# EAGLE design Hub (EAGLE 7.6.0)
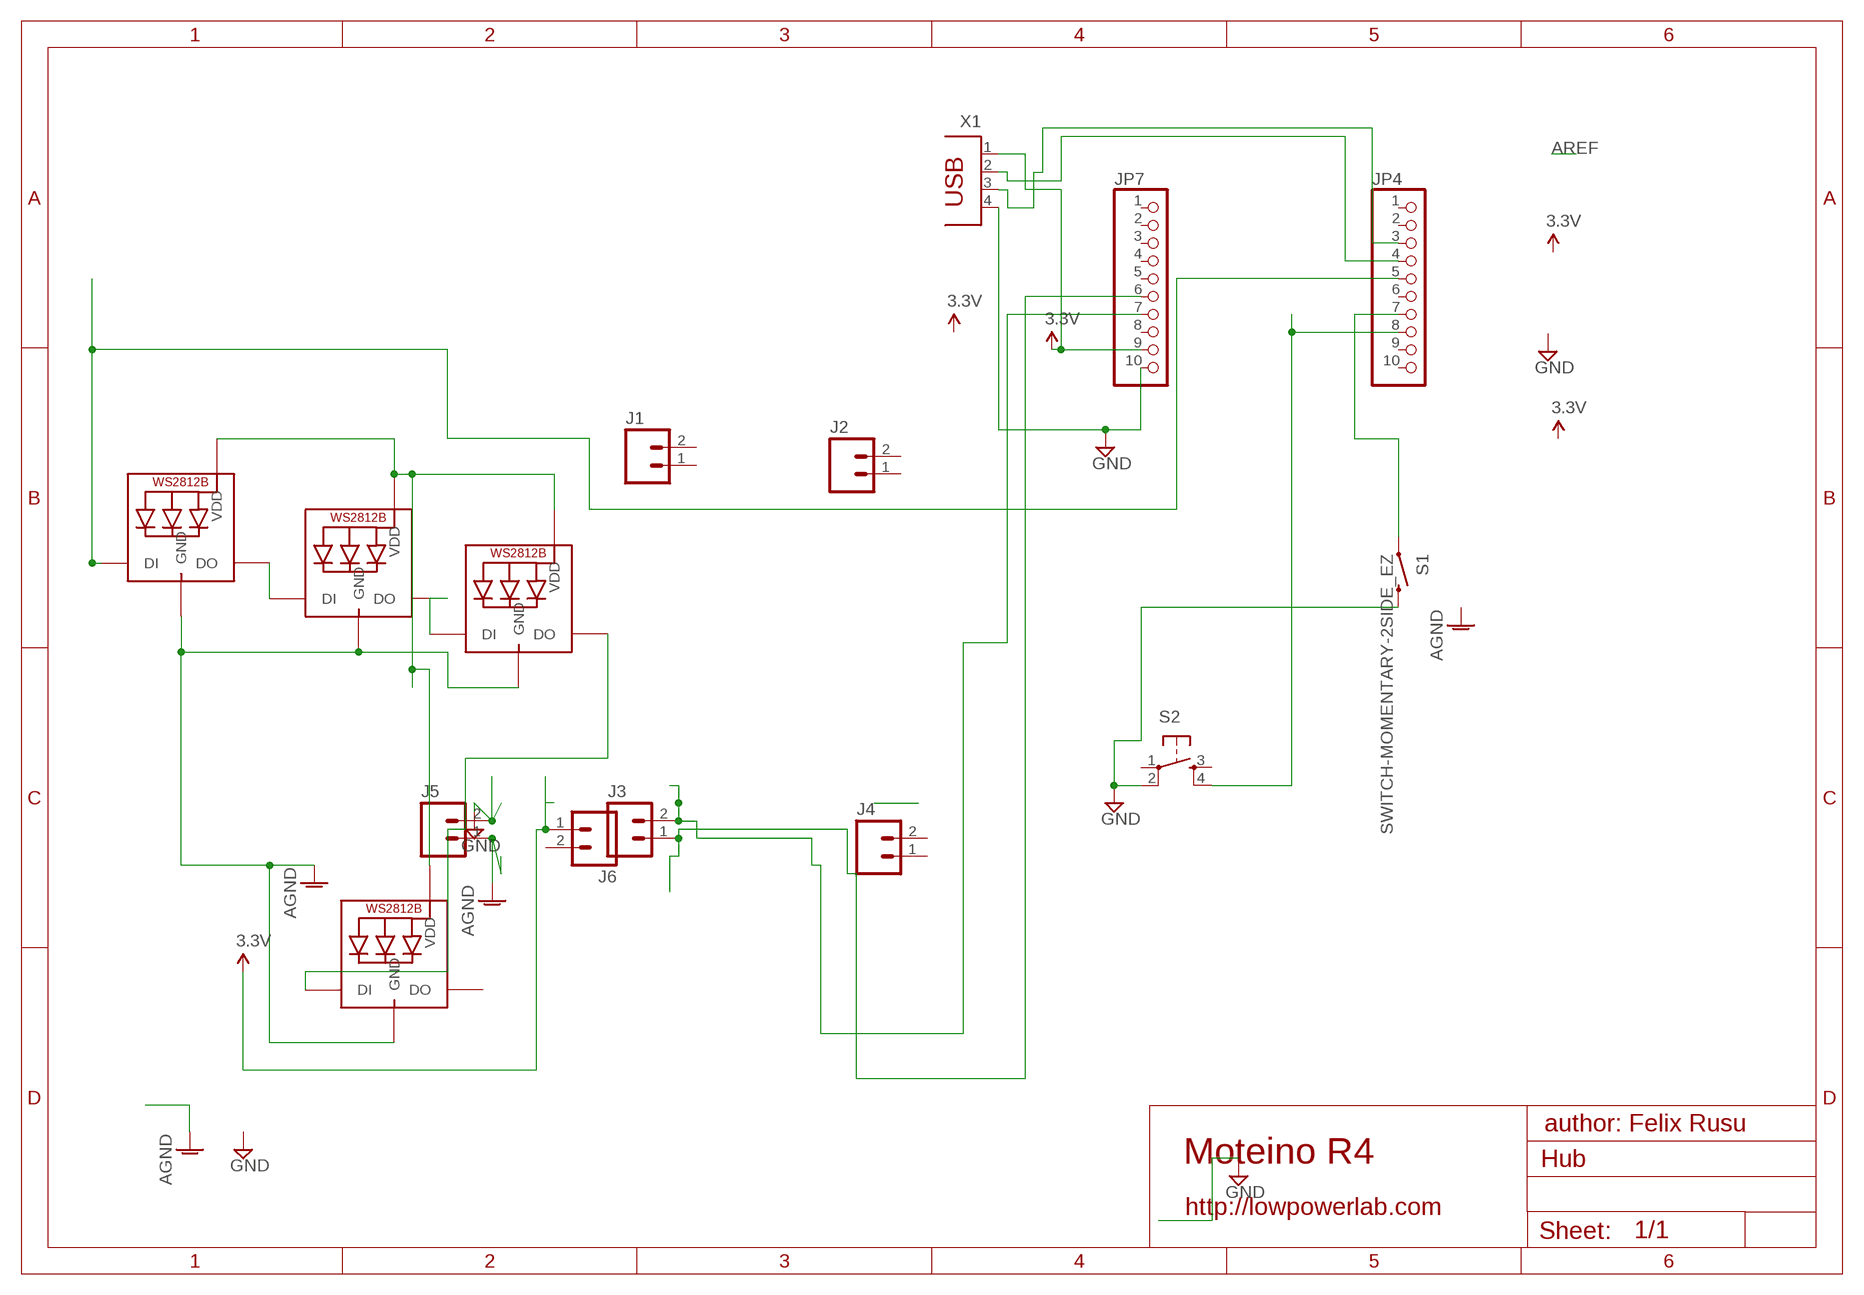
[diagram p0: schematic, sheet 1]

## Parts
J1  M02PTH  [1X02]
J2  M02PTH  [1X02]
J3  M02PTH  [1X02]
J4  M02PTH  [1X02]
J5  M02PTH  [1X02]
J6  M02PTH  [1X02]
JP4  PINHD-1X10  [1X10]
JP7  PINHD-1X10  [1X10]
LED1  WS2812B5050  [WS2812B]
LED2  WS2812B5050  [WS2812B]
LED3  WS2812B5050  [WS2812B]
LED5  WS2812B5050  [WS2812B]
S1  SWITCH-MOMENTARY-2SIDE_EZ  [TACTILE-PTH-SIDEEZ]
S2  TAC_SWITCHPTH  [TACTILE-PTH]
X1  PN87520  [PN87520]

## Nets
AGND [power]: J5.1 LED1.3-GND(GND) LED2.3-GND(GND) LED3.3-GND(GND) LED5.3-GND(GND)
GND [power]: J5.2 JP7.10 S1.2 S2.2 X1.4
N$1: JP4.8 S2.4
N$2: LED3.2-DOUT(DO) LED5.4-DIN(DI)
N$4 [power]: JP4.5 LED1.4-DIN(DI)
N$6: LED1.1-VDD(VDD) LED2.1-VDD(VDD) LED3.1-VDD(VDD) LED5.1-VDD(VDD)
N$10: JP4.7 S1.1
N$12: J3.2 JP7.7
N$22: J3.1 JP7.6
N$23: JP4.4 X1.2
N$25: JP4.3 X1.3
N$29: LED2.2-DOUT(DO) LED3.4-DIN(DI)
N$31: LED1.2-DOUT(DO) LED2.4-DIN(DI)
VCC: J6.1 JP7.9 X1.1 ; supply symbol labelled 3.3V
Unconnected: J1.1 J1.2 J2.1 J2.2 J4.1 J4.2 J6.2 JP4.1 JP4.2 JP4.6 JP4.9 JP4.10 JP7.1 JP7.2 JP7.3 JP7.4 JP7.5 JP7.8 LED5.2-DOUT(DO) S2.1 S2.3

## Notes on the sheet
- author: Felix Rusu
- Moteino R4
- http://lowpowerlab.com

## Library data of the parts
J1-J6 = SparkFun-Connectors:M02: Standard 2-pin 0.1" header. Use with - straight break away headers ( PRT-00116) - right angle break away headers (PRT-00553) - swiss pins (PRT-00743) - machine pins (PRT-00117) - female headers (PRT-00115) Molex polarized connector foot print use with: PRT-08233 with associated crimp pins and housings. 2.54_SCREWTERM for use with PRT-10571. 3.5mm Screw Terminal footprints for PRT-08084 5mm Screw Terminal footprints for use with PRT-08432
JP4 JP7 = pinhead:PINHD-1X10: PIN HEADER
LED1-LED3 LED5 = adafruit:WS2812B
S1 = SparkFun-Electromechanical:SWITCH-MOMENTARY-2: Various NO switches- pushbuttons, reed, etc
S2 = SparkFun-Retired:TAC_SWITCH: Momentary Switch Button commonly used for reset or general input. Spark Fun Electronics SKU : COM-00097 SMT- SWCH-08247
X1 = con-berg:PN87520: BERG USB connector; OC_FARNELL: unknown; OC_NEWARK: unknown

## Net classes
1 power: width 0.381 mm, clearance 0.254 mm

## Board
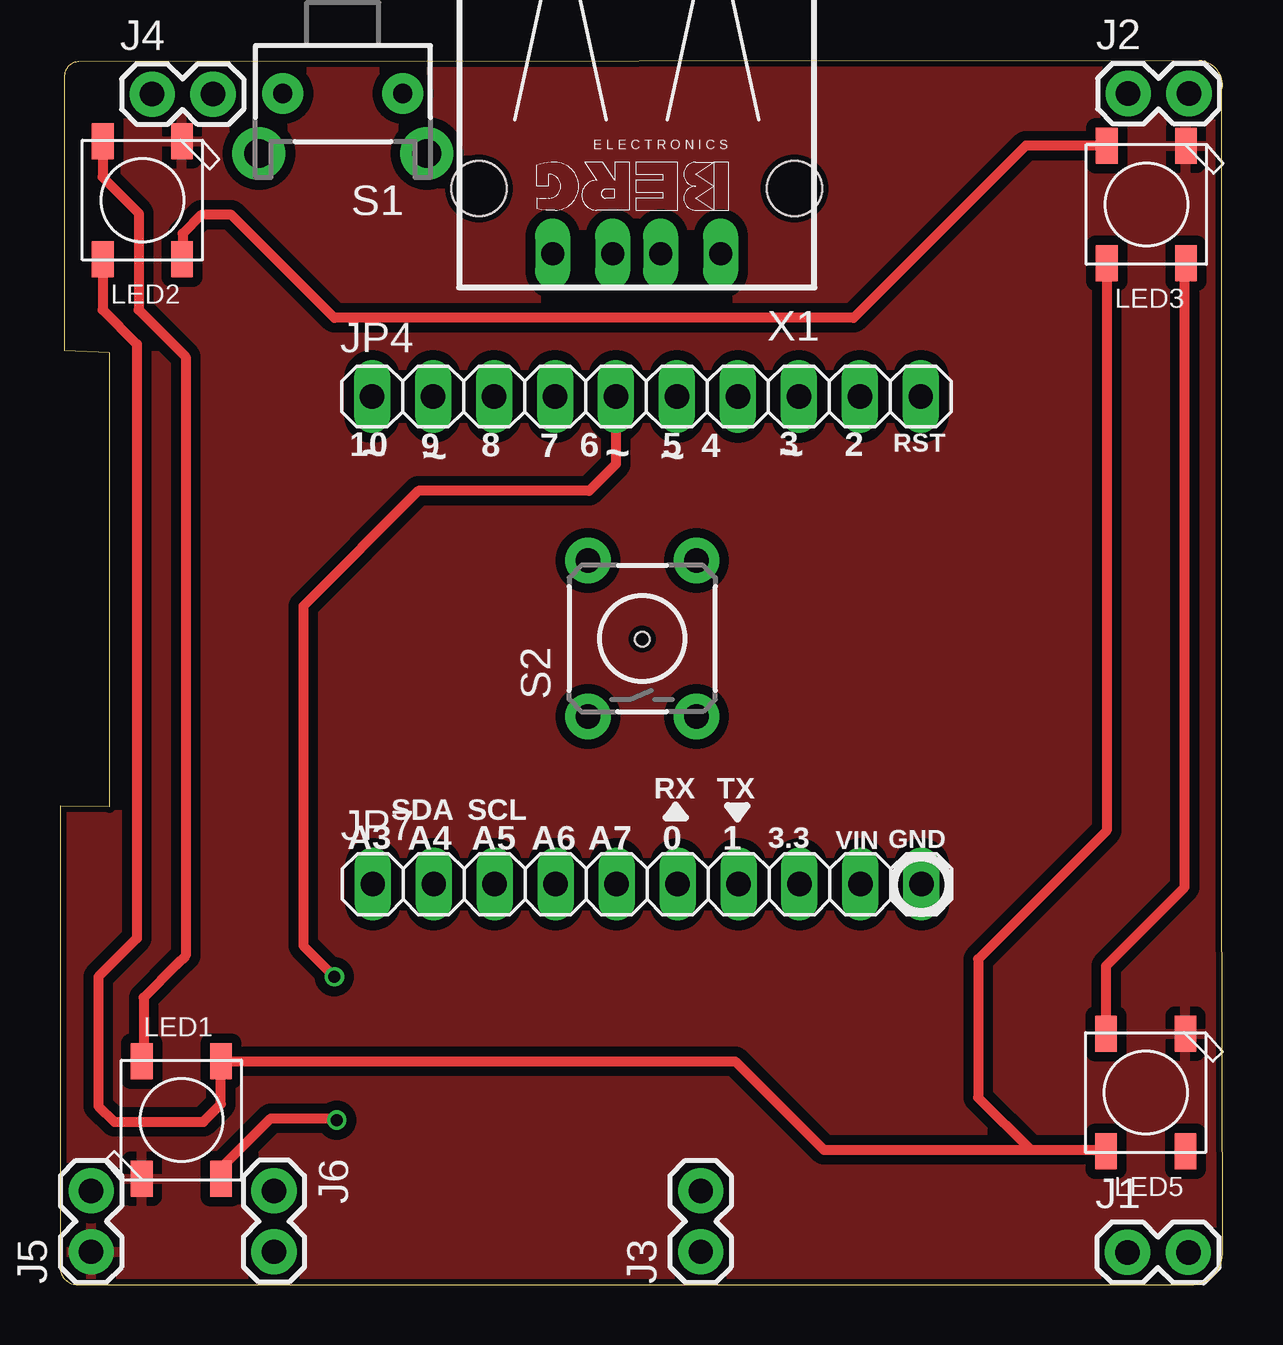
[diagram p1: board, top side]
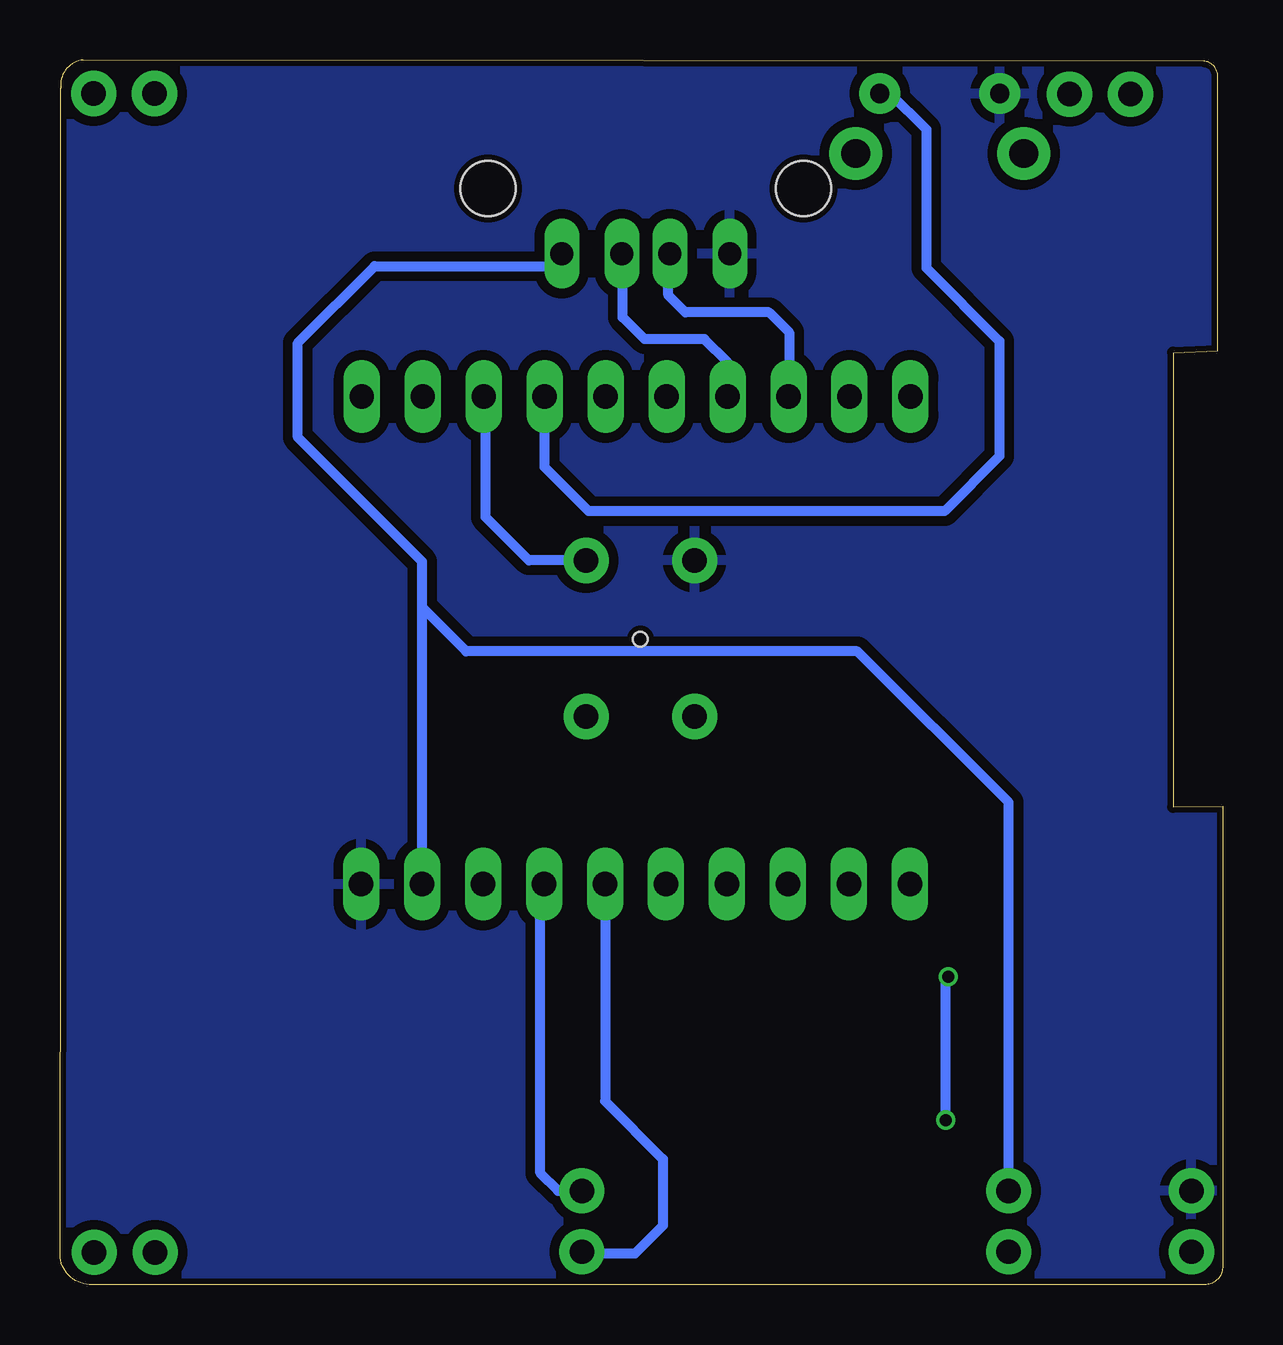
[diagram p2: board, bottom side, seen from below]

Size 48.44 x 51.03 mm. Coordinates in mm from the lower left corner, seen from the top.
Outline: 2.06,38.84 2.06,19.91 0,19.94 0,0.79 arc90 0.69,0 47.22,0 arc90 48.44,1.37 48.41,18.01 48.41,49.86 arc90 47.47,51.03 0.79,50.98 arc90 0.2,50.34 0.2,38.91 2.06,38.84
Copper layers (1*16): Top 0.035mm / dielectric 1.5mm / Bottom 0.035mm
Design rules "ITEADstudio_DRC *": minimum track width 6mil, minimum drill 12mil, track to track 16mil, track to pad 12mil, pad to pad 12mil, via to via 12mil, smd to smd 0mil, copper to edge 10mil, drill to drill 10mil, minimum pad ring 10mil, minimum via ring 6mil, stop-mask expansion 2mil, vias tented up to drill 100mil, thermal gap 15mil
Holes 0.6 mm at 24.26,26.9

### Footprints (pad centres in the part's own frame; a part is rotated, then mirrored left to right if it is on the bottom)
1X02 = drill 1.016 pad 1.88: 1 0,0; 2 2.54,0
1X10 = drill 1.016 long: 1 -11.43,0; 2 -8.89,0; 3 -6.35,0; 4 -3.81,0; 5 -1.27,0; 6 1.27,0; 7 3.81,0; 8 6.35,0; 9 8.89,0; 10 11.43,0
WS2812B = smd 1.5 x 0.9: 1-VDD 2.45,-1.65; 2-DOUT 2.45,1.65; 3-GND -2.45,1.65; 4-DIN -2.45,-1.65
TACTILE-PTH-SIDEEZ = drill 0.8 pad 1.7: 1 -2.5,0; 2 2.5,0 | drill 1.2 pad 2.2: ANCHOR1 -3.5,2.5; ANCHOR2 3.5,2.5
TACTILE-PTH = drill 1.016 pad 1.88: 1 -3.251,2.261; 2 3.251,2.261; 3 -3.251,-2.261; 4 3.251,-2.261
PN87520 = drill 0.95 long: 1 -3.5,2.71; 2 -1,2.71; 3 1,2.71; 4 3.5,2.71 | hole 2.3: -6.57,0; 6.57,0

### Placement (x,y rotation side)
J1  44.48,1.35 0 top
J2  44.5,49.63 0 top
J3  26.7,1.37 90 top
J4  3.84,49.61 0 top
J5  1.3,1.37 90 top
J6  8.92,3.91 270 top
JP4  24.44,37.01 0 top
JP7  24.46,16.69 0 top
LED1  5.06,6.86 90 top
LED2  3.43,45.19 270 top
LED3  45.26,45.01 270 top
LED5  45.24,8 270 top
S1  11.79,49.63 180 top
S2  24.26,26.92 90 top
X1  24.03,45.67 180 top

### Tracks (layer width: path | path; a pad name or v marks a point on that pad's centre or on a via)
AGND
  pour Top: 65.61,59.64 65.61,-0.58 -7.75,-0.58 -7.75,59.61
GND
  pour Bottom: -7.67,57.48 67.72,57.1 67.87,-1.27 -7.77,-0.71
N$1
  Bottom 0.406: S2.4 28.91,30.18 30.71,31.98 30.71,36.93 JP4.8
N$2
  Top 0.406: LED5.4-DIN 43.59,13.29 46.86,16.56 46.86,42.51 LED3.2-DOUT
N$4  (via drill 0.5)
  Top 0.406: JP4.5 23.17,34.19 22.05,33.07 14.94,33.07 10.14,28.27 10.14,14.12 v11.43,12.83 | 11.38,6.98 11.41,7.01 11.53,6.88 v11.53,6.86 11.46,6.93 8.79,6.93 6.71,4.85 LED1.4-DIN
  Bottom 0.406: v11.53,6.86 11.53,12.72 v11.43,12.83
N$6
  Top 0.406: 40.44,5.61 31.83,5.61 28.13,9.31 LED1.1-VDD 6.71,7.52 5.97,6.78 2.26,6.78 1.6,7.44 1.6,12.83 3.2,14.43 3.2,39.19 1.78,40.61 LED2.1-VDD | 40.44,5.61 43.53,5.61 LED5.1-VDD | LED3.1-VDD 43.61,18.92 38.25,13.56 38.25,7.8 40.44,5.61
N$10
  Bottom 0.406: JP4.7 28.25,34.06 26.42,32.23 11.58,32.23 9.3,34.52 9.3,39.32 12.35,42.37 12.35,48.13 13.84,49.63 S1.1
N$12
  Bottom 0.406: J3.2 27.69,3.91 28.42,4.65 28.42,16.54 JP7.7
N$22
  Bottom 0.406: JP7.6 25.73,7.64 23.32,5.23 23.32,2.46 24.49,1.3 26.62,1.3 J3.1
N$23
  Bottom 0.406: JP4.4 20.63,38.43 21.59,39.4 24.08,39.4 25,40.31 25,42.92 X1.2
N$25
  Bottom 0.406: JP4.3 18.06,37.03 18.06,39.68 18.9,40.51 22.38,40.51 23.09,41.22 23.09,42.9 X1.3
N$29
  Top 0.406: LED3.4-DIN 40.25,47.46 33.07,40.28 11.43,40.28 7.14,44.58 5.89,44.58 5.11,43.79 5.11,42.76 LED2.2-DOUT
N$31
  Top 0.406: 3.35,9.36 LED1.2-DOUT 3.48,9.38 3.48,11.96 4.87,13.35 5.23,13.72 5.23,38.66 3.28,40.62 3.28,44.65 1.78,46.15 LED2.4-DIN
VCC
  Bottom 0.406: JP7.9 33.35,28.22 | 33.35,28.22 33.35,30.12 38.53,35.31 38.53,39.24 35.33,42.44 28.05,42.44 X1.1 | J6.1 8.92,20.09 15.22,26.39 31.52,26.39 33.35,28.22

### Text on the board
_tsilk: ~ | ~ | ~ | ~ | ~ | RST | 10 | 9 | 8 | 7 | 6 | 5 | 4 | 3 | 2 | SDA | SCL | RX | TX | A3 | A4 | A5 | A6 | A7 | 0 | 1 | 3.3 | VIN | GND